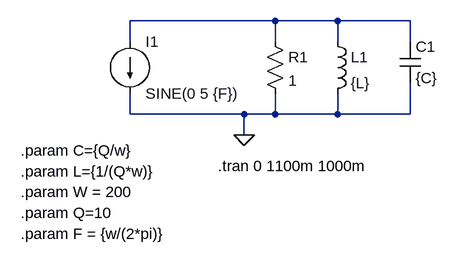
[diagram p0: schematic Circuito RLC con fuente de corriente (Paralelo).asc]
Circuito RLC con fuente de corriente (Paralelo).asc, the LTspice schematic file:
Version 4
SHEET 1 880 680
WIRE 272 96 48 96
WIRE 368 96 272 96
WIRE 480 96 368 96
WIRE 48 128 48 96
WIRE 272 128 272 96
WIRE 368 128 368 96
WIRE 480 128 480 96
WIRE 48 240 48 208
WIRE 224 240 48 240
WIRE 272 240 272 208
WIRE 272 240 224 240
WIRE 368 240 368 208
WIRE 368 240 272 240
WIRE 480 240 480 192
WIRE 480 240 368 240
WIRE 224 272 224 240
FLAG 224 272 0
SYMBOL res 256 112 R0
SYMATTR InstName R1
SYMATTR Value 1
SYMBOL cap 464 128 R0
SYMATTR InstName C1
SYMATTR Value {C}
SYMBOL ind 352 112 R0
SYMATTR InstName L1
SYMATTR Value {L}
SYMBOL current 48 128 R0
WINDOW 123 0 0 Left 0
WINDOW 39 0 0 Left 0
SYMATTR InstName I1
SYMATTR Value SINE(0 5 {F})
TEXT -120 424 Left 2 !.param F = {w/(2*pi)}
TEXT -120 296 Left 2 !.param C={Q/w}
TEXT -120 328 Left 2 !.param L={1/(Q*w)}
TEXT -120 360 Left 2 !.param W = 200
TEXT -120 392 Left 2 !.param Q=10
TEXT 184 320 Left 2 !.tran 0 1100m 1000m

The netlist it stands for:
* Circuito RLC con fuente de corriente (Paralelo).asc
R1 N001 0 1
C1 N001 0 {C}
L1 N001 0 {L}
I1 N001 0 SINE(0 5 {F})
.param F = {w/(2*pi)}
.param C={Q/w}
.param L={1/(Q*w)}
.param W = 200
.param Q=10
.tran 0 1100m 1000m
.backanno
.end